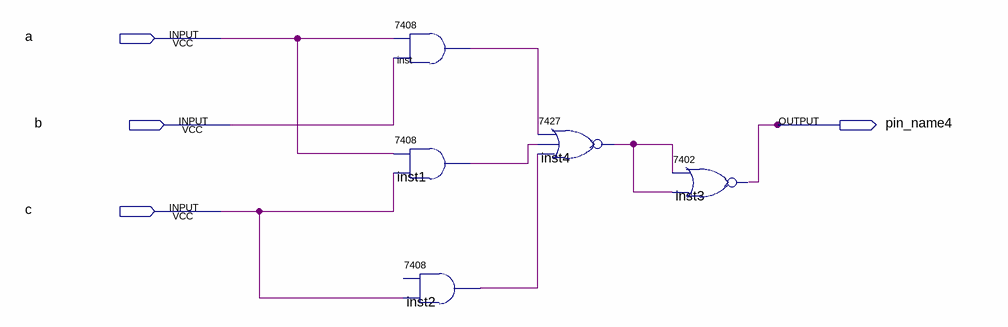
[diagram p0: schematic sheet]
// Quartus schematic Questao4.bdf as structural Verilog: 5 symbols, 4 pins
module Questao4 (
  input  a,
  input  b,
  input  c,
  output pin_name4
);

  wire inst1_1, inst2_1, inst4_1, inst_1;

  \7408  inst (.\3 (b), .\2 (a), .\1 (inst_1));
  \7408  inst1 (.\3 (c), .\2 (a), .\1 (inst1_1));
  \7408  inst2 (.\3 (c), .\1 (inst2_1));  // open: 2
  \7427  inst4 (.\4 (inst2_1), .\3 (inst1_1), .\2 (inst_1), .\1 (inst4_1));
  \7402  inst3 (.\2 (inst4_1), .\3 (inst4_1), .\1 (pin_name4));
endmodule
